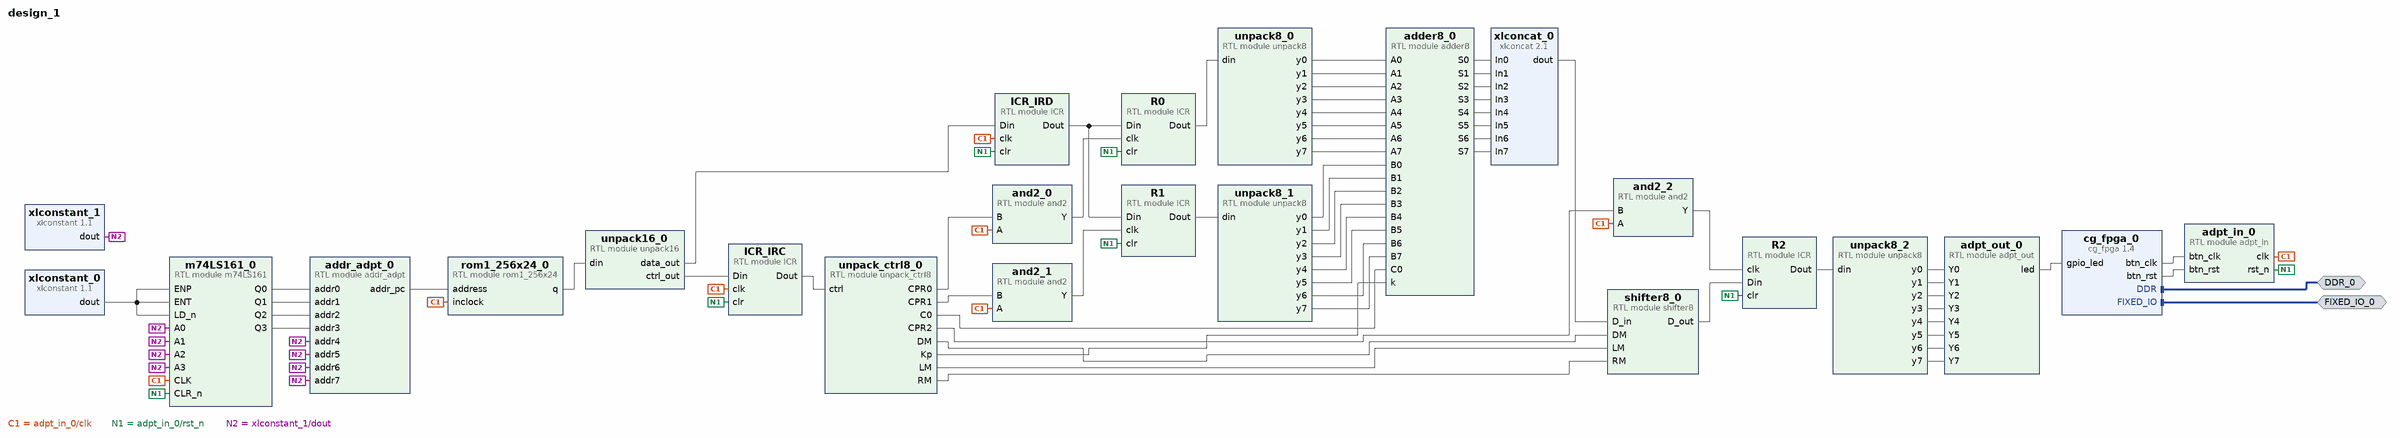
[diagram p0: block diagram of the top level]
# Vivado block design design_1, xc7z020clg400-1, Vivado 2024.2
create_bd_design design_1

create_bd_intf_port -mode Master -vlnv xilinx.com:display_processing_system7:fixedio_rtl:1.0 FIXED_IO_0
create_bd_intf_port -mode Master -vlnv xilinx.com:interface:ddrx_rtl:1.0 DDR_0

create_bd_cell -type ip -vlnv educg.net:user:cg_fpga:1.4 cg_fpga_0
create_bd_cell -type module -reference adpt_in adpt_in_0
create_bd_cell -type module -reference adpt_out adpt_out_0
create_bd_cell -type module -reference m74LS161 m74LS161_0
create_bd_cell -type ip -vlnv xilinx.com:ip:xlconstant:1.1 xlconstant_0
create_bd_cell -type module -reference addr_adpt addr_adpt_0
create_bd_cell -type ip -vlnv xilinx.com:ip:xlconstant:1.1 xlconstant_1
set_property -dict {CONFIG.CONST_VAL 0} [get_bd_cells xlconstant_1]
create_bd_cell -type module -reference rom1_256x24 rom1_256x24_0
create_bd_cell -type module -reference ICR ICR_IRD
create_bd_cell -type module -reference ICR ICR_IRC
create_bd_cell -type module -reference unpack16 unpack16_0
create_bd_cell -type module -reference ICR R0
create_bd_cell -type module -reference ICR R1
create_bd_cell -type module -reference ICR R2
create_bd_cell -type module -reference and2 and2_0
create_bd_cell -type module -reference unpack_ctrl8 unpack_ctrl8_0
create_bd_cell -type module -reference and2 and2_1
create_bd_cell -type module -reference and2 and2_2
create_bd_cell -type module -reference adder8 adder8_0
create_bd_cell -type module -reference unpack8 unpack8_0
create_bd_cell -type module -reference unpack8 unpack8_1
create_bd_cell -type module -reference unpack8 unpack8_2
create_bd_cell -type ip -vlnv xilinx.com:ip:xlconcat:2.1 xlconcat_0
set_property -dict {CONFIG.NUM_PORTS 8} [get_bd_cells xlconcat_0]
create_bd_cell -type module -reference shifter8 shifter8_0

# ---- connections ----

connect_bd_intf_net [get_bd_intf_ports DDR_0] [get_bd_intf_pins cg_fpga_0/DDR]
connect_bd_intf_net [get_bd_intf_ports FIXED_IO_0] [get_bd_intf_pins cg_fpga_0/FIXED_IO]
connect_bd_net [get_bd_pins ICR_IRC/Dout] [get_bd_pins unpack_ctrl8_0/ctrl]
connect_bd_net [get_bd_pins ICR_IRD/Dout] [get_bd_pins R0/Din] [get_bd_pins R1/Din]
connect_bd_net [get_bd_pins R0/Dout] [get_bd_pins unpack8_0/din]
connect_bd_net [get_bd_pins R1/Dout] [get_bd_pins unpack8_1/din]
connect_bd_net [get_bd_pins R2/Dout] [get_bd_pins unpack8_2/din]
connect_bd_net [get_bd_pins adder8_0/S0] [get_bd_pins xlconcat_0/In0]
connect_bd_net [get_bd_pins adder8_0/S1] [get_bd_pins xlconcat_0/In1]
connect_bd_net [get_bd_pins adder8_0/S2] [get_bd_pins xlconcat_0/In2]
connect_bd_net [get_bd_pins adder8_0/S3] [get_bd_pins xlconcat_0/In3]
connect_bd_net [get_bd_pins adder8_0/S4] [get_bd_pins xlconcat_0/In4]
connect_bd_net [get_bd_pins adder8_0/S5] [get_bd_pins xlconcat_0/In5]
connect_bd_net [get_bd_pins adder8_0/S6] [get_bd_pins xlconcat_0/In6]
connect_bd_net [get_bd_pins adder8_0/S7] [get_bd_pins xlconcat_0/In7]
connect_bd_net [get_bd_pins addr_adpt_0/addr_pc] [get_bd_pins rom1_256x24_0/address]
connect_bd_net [get_bd_pins adpt_in_0/clk] \
  [get_bd_pins ICR_IRD/clk] [get_bd_pins ICR_IRC/clk] [get_bd_pins and2_0/A] [get_bd_pins and2_1/A] [get_bd_pins and2_2/A] \
  [get_bd_pins m74LS161_0/CLK] [get_bd_pins rom1_256x24_0/inclock]
connect_bd_net [get_bd_pins adpt_in_0/rst_n] \
  [get_bd_pins ICR_IRD/clr] [get_bd_pins R2/clr] [get_bd_pins ICR_IRC/clr] [get_bd_pins R0/clr] [get_bd_pins R1/clr] \
  [get_bd_pins m74LS161_0/CLR_n]
connect_bd_net [get_bd_pins adpt_out_0/led] [get_bd_pins cg_fpga_0/gpio_led]
connect_bd_net [get_bd_pins and2_0/Y] [get_bd_pins R0/clk]
connect_bd_net [get_bd_pins and2_1/Y] [get_bd_pins R1/clk]
connect_bd_net [get_bd_pins and2_2/Y] [get_bd_pins R2/clk]
connect_bd_net [get_bd_pins cg_fpga_0/btn_clk] [get_bd_pins adpt_in_0/btn_clk]
connect_bd_net [get_bd_pins cg_fpga_0/btn_rst] [get_bd_pins adpt_in_0/btn_rst]
connect_bd_net [get_bd_pins m74LS161_0/Q0] [get_bd_pins addr_adpt_0/addr0]
connect_bd_net [get_bd_pins m74LS161_0/Q1] [get_bd_pins addr_adpt_0/addr1]
connect_bd_net [get_bd_pins m74LS161_0/Q2] [get_bd_pins addr_adpt_0/addr2]
connect_bd_net [get_bd_pins m74LS161_0/Q3] [get_bd_pins addr_adpt_0/addr3]
connect_bd_net [get_bd_pins rom1_256x24_0/q] [get_bd_pins unpack16_0/din]
connect_bd_net [get_bd_pins shifter8_0/D_out] [get_bd_pins R2/Din]
connect_bd_net [get_bd_pins unpack16_0/ctrl_out] [get_bd_pins ICR_IRC/Din]
connect_bd_net [get_bd_pins unpack16_0/data_out] [get_bd_pins ICR_IRD/Din]
connect_bd_net [get_bd_pins unpack8_0/y0] [get_bd_pins adder8_0/A0]
connect_bd_net [get_bd_pins unpack8_0/y1] [get_bd_pins adder8_0/A1]
connect_bd_net [get_bd_pins unpack8_0/y2] [get_bd_pins adder8_0/A2]
connect_bd_net [get_bd_pins unpack8_0/y3] [get_bd_pins adder8_0/A3]
connect_bd_net [get_bd_pins unpack8_0/y4] [get_bd_pins adder8_0/A4]
connect_bd_net [get_bd_pins unpack8_0/y5] [get_bd_pins adder8_0/A5]
connect_bd_net [get_bd_pins unpack8_0/y6] [get_bd_pins adder8_0/A6]
connect_bd_net [get_bd_pins unpack8_0/y7] [get_bd_pins adder8_0/A7]
connect_bd_net [get_bd_pins unpack8_1/y0] [get_bd_pins adder8_0/B0]
connect_bd_net [get_bd_pins unpack8_1/y1] [get_bd_pins adder8_0/B1]
connect_bd_net [get_bd_pins unpack8_1/y2] [get_bd_pins adder8_0/B2]
connect_bd_net [get_bd_pins unpack8_1/y3] [get_bd_pins adder8_0/B3]
connect_bd_net [get_bd_pins unpack8_1/y4] [get_bd_pins adder8_0/B4]
connect_bd_net [get_bd_pins unpack8_1/y5] [get_bd_pins adder8_0/B5]
connect_bd_net [get_bd_pins unpack8_1/y6] [get_bd_pins adder8_0/B6]
connect_bd_net [get_bd_pins unpack8_1/y7] [get_bd_pins adder8_0/B7]
connect_bd_net [get_bd_pins unpack8_2/y0] [get_bd_pins adpt_out_0/Y0]
connect_bd_net [get_bd_pins unpack8_2/y1] [get_bd_pins adpt_out_0/Y1]
connect_bd_net [get_bd_pins unpack8_2/y2] [get_bd_pins adpt_out_0/Y2]
connect_bd_net [get_bd_pins unpack8_2/y3] [get_bd_pins adpt_out_0/Y3]
connect_bd_net [get_bd_pins unpack8_2/y4] [get_bd_pins adpt_out_0/Y4]
connect_bd_net [get_bd_pins unpack8_2/y5] [get_bd_pins adpt_out_0/Y5]
connect_bd_net [get_bd_pins unpack8_2/y6] [get_bd_pins adpt_out_0/Y6]
connect_bd_net [get_bd_pins unpack8_2/y7] [get_bd_pins adpt_out_0/Y7]
connect_bd_net [get_bd_pins unpack_ctrl8_0/C0] [get_bd_pins adder8_0/C0]
connect_bd_net [get_bd_pins unpack_ctrl8_0/CPR0] [get_bd_pins and2_0/B]
connect_bd_net [get_bd_pins unpack_ctrl8_0/CPR1] [get_bd_pins and2_1/B]
connect_bd_net [get_bd_pins unpack_ctrl8_0/CPR2] [get_bd_pins and2_2/B]
connect_bd_net [get_bd_pins unpack_ctrl8_0/DM] [get_bd_pins shifter8_0/DM]
connect_bd_net [get_bd_pins unpack_ctrl8_0/Kp] [get_bd_pins adder8_0/k]
connect_bd_net [get_bd_pins unpack_ctrl8_0/LM] [get_bd_pins shifter8_0/LM]
connect_bd_net [get_bd_pins unpack_ctrl8_0/RM] [get_bd_pins shifter8_0/RM]
connect_bd_net [get_bd_pins xlconcat_0/dout] [get_bd_pins shifter8_0/D_in]
connect_bd_net [get_bd_pins xlconstant_0/dout] [get_bd_pins m74LS161_0/ENP] [get_bd_pins m74LS161_0/ENT] [get_bd_pins m74LS161_0/LD_n]
connect_bd_net [get_bd_pins xlconstant_1/dout] \
  [get_bd_pins addr_adpt_0/addr7] [get_bd_pins addr_adpt_0/addr6] [get_bd_pins addr_adpt_0/addr5] \
  [get_bd_pins addr_adpt_0/addr4] [get_bd_pins m74LS161_0/A3] [get_bd_pins m74LS161_0/A2] [get_bd_pins m74LS161_0/A1] \
  [get_bd_pins m74LS161_0/A0]

validate_bd_design
save_bd_design
